# Altium schematic sheet FT4232.schdoc
size 274 x 231 mm; SheetNumber: 1; SheetTotal: 1
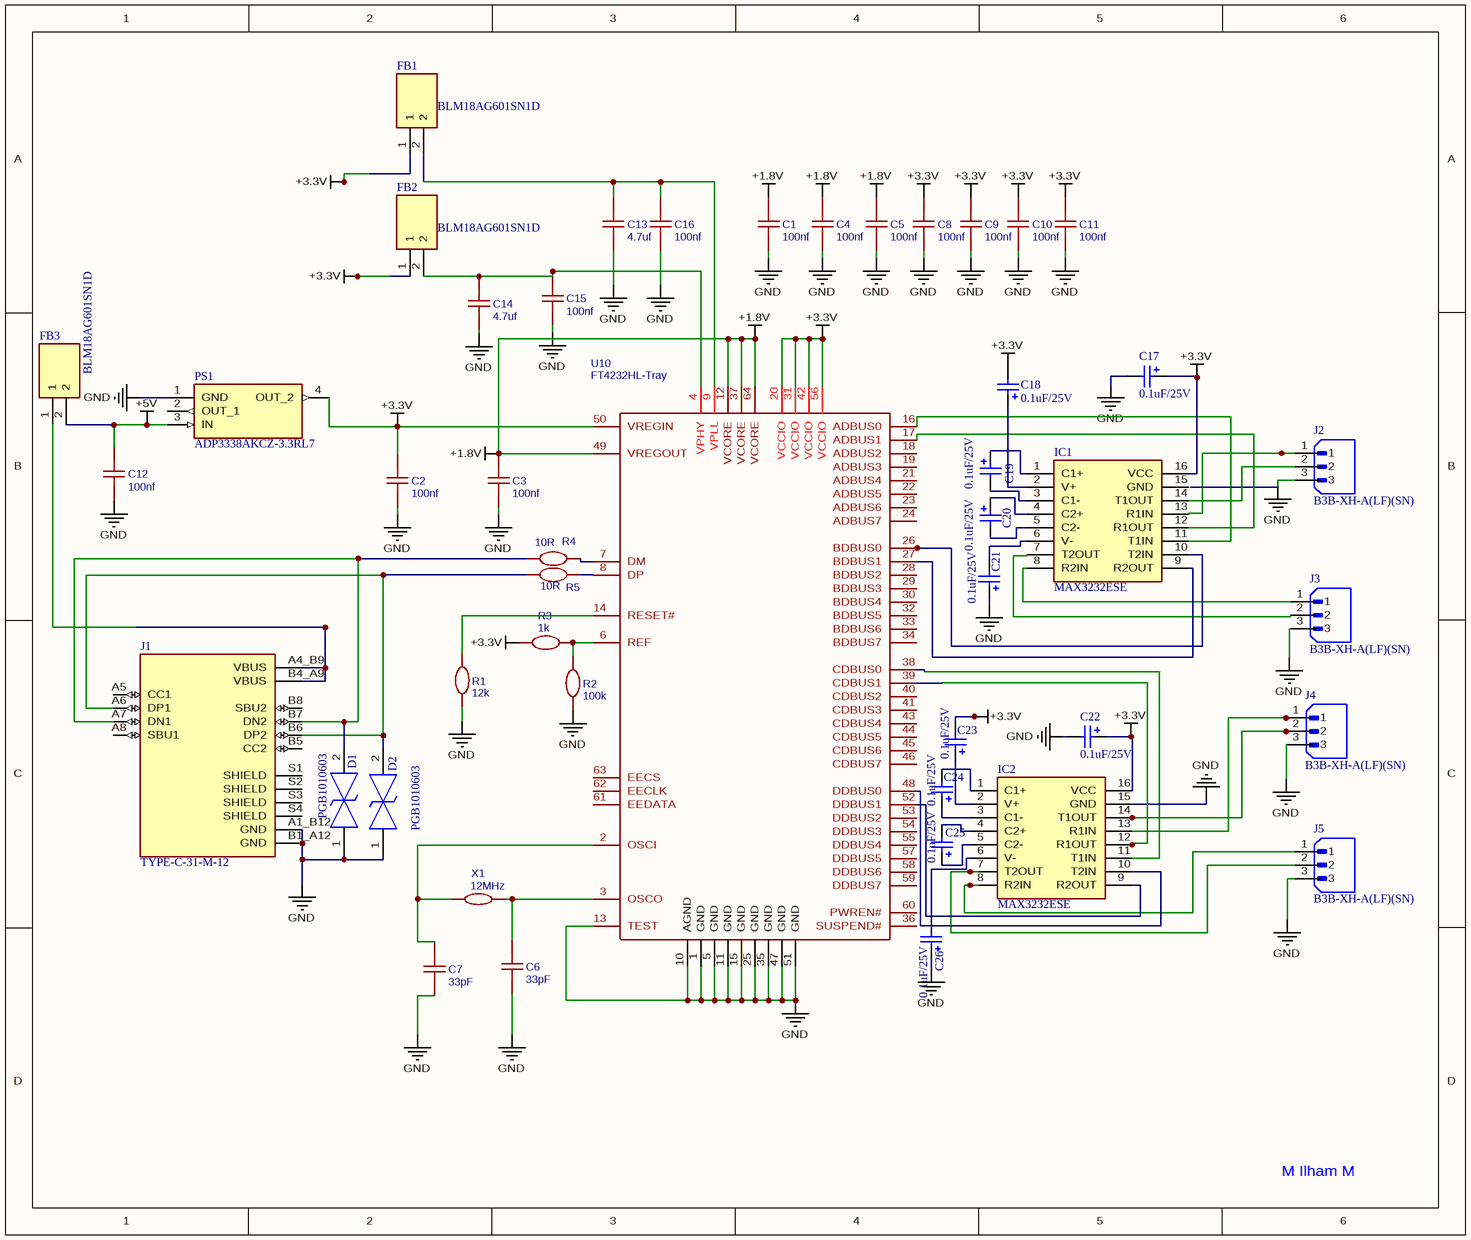
[diagram p0: FT4232.schdoc]

## Parts
C1  100nf  [1608_[0603] Capacitor]
C2  100nf  [1608_[0603] Capacitor]
C3  100nf  [1608_[0603] Capacitor]
C4  100nf  [1608_[0603] Capacitor]
C5  100nf  [1608_[0603] Capacitor]
C6  33pF  [1608_[0603] Capacitor]
C7  33pF  [1608_[0603] Capacitor]
C8  100nf  [1608_[0603] Capacitor]
C9  100nf  [1608_[0603] Capacitor]
C10  100nf  [1608_[0603] Capacitor]
C11  100nf  [1608_[0603] Capacitor]
C12  100nf  [1608_[0603] Capacitor]
C13  4.7uf  [1608_[0603] Capacitor]
C14  4.7uf  [1608_[0603] Capacitor]
C15  100nf  [1608_[0603] Capacitor]
C16  100nf  [1608_[0603] Capacitor]
C17  0.1uF/25V  [1608_[0603] Capacitor]
C18  0.1uF/25V  [1608_[0603] Capacitor]
C19  0.1uF/25V  [1608_[0603] Capacitor]
C20  0.1uF/25V  [1608_[0603] Capacitor]
C21  0.1uF/25V  [1608_[0603] Capacitor]
C22  0.1uF/25V  [1608_[0603] Capacitor]
C23  0.1uF/25V  [1608_[0603] Capacitor]
C24  0.1uF/25V  [1608_[0603] Capacitor]
C25  0.1uF/25V  [1608_[0603] Capacitor]
C26  0.1uF/25V  [1608_[0603] Capacitor]
D1  PGB1010603  [PGB1010603NRHF]
D2  PGB1010603  [PGB1010603NRHF]
FB1  BLM18AG601SN1D  [BLM18SP221SN1B]
FB2  BLM18AG601SN1D  [BLM18SP221SN1B]
FB3  BLM18AG601SN1D  [BLM18SP221SN1B]
IC1  MAX3232ESE  [SOIC127P600X175-16N]
IC2  MAX3232ESE  [SOIC127P600X175-16N]
J1  TYPE-C-31-M-12  [HRO_TYPE-C-31-M-12]
J2  B3B-XH-A(LF)(SN)  [JST_B3B-XH-A(LF)(SN)]
J3  B3B-XH-A(LF)(SN)  [JST_B3B-XH-A(LF)(SN)]
J4  B3B-XH-A(LF)(SN)  [JST_B3B-XH-A(LF)(SN)]
J5  B3B-XH-A(LF)(SN)  [JST_B3B-XH-A(LF)(SN)]
PS1  ADP3338AKCZ-3.3RL7  [SOT230P700X180-4N]
R1  12k  [1608_[0603] Resistor]
R2  100k  [1608_[0603] Resistor]
R3  1k  [1608_[0603] Resistor]
R4  10R  [1608_[0603] Resistor]
R5  10R  [1608_[0603] Resistor]
U10  FT4232HL-Tray  [QFP50P1200X1200X160-64N]
X1  12MHz  [X TAL]

## Nets
+1.8V: C1.1 C3.1 C4.1 C5.1 U10.12(VCORE) U10.37(VCORE) U10.49(VREGOUT) U10.64(VCORE)
+3.3V: C2.1 C8.1 C9.1 C10.1 C11.1 C17.1 C18.2 C22.1 C23.2 FB1.1 FB2.1 IC1.16(VCC) IC2.16(VCC) PS1.4(OUT_2) R3.1 U10.20(VCCIO) U10.31(VCCIO) U10.42(VCCIO) U10.50(VREGIN) U10.56(VCCIO)
+5V: C12.1 FB3.2 PS1.3(IN)
GND: C1.2 C2.2 C3.2 C4.2 C5.2 C6.2 C7.2 C8.2 C9.2 C10.2 C11.2 C12.2 C13.2 C14.2 C15.2 C16.2 C17.2 C21.1 C22.2 C26.1 D1.1 D2.1 IC2.15(GND) J1.A1_B12(GND) J1.B1_A12(GND) J2.3 J3.3 J4.3 J5.3 PS1.1(GND) R1.2 R2.2 U10.1(GND) U10.5(GND) U10.10(AGND) U10.11(GND) U10.13(TEST) U10.15(GND) U10.25(GND) U10.35(GND) U10.47(GND) U10.51(GND)
NetC6_1: C6.1 U10.3(OSCO) X1.2
NetC7_1: C7.1 U10.2(OSCI) X1.1
NetC13_1: C13.1 C16.1 FB1.2 U10.9(VPLL)
NetC14_1: C14.1 C15.1 FB2.2 U10.4(VPHY)
NetC18_1: C18.1 IC1.2(V+)
NetC19_1: C19.1 IC1.1(C1+)
NetC19_2: C19.2 IC1.3(C1-)
NetC20_1: C20.1 IC1.4(C2+)
NetC20_2: C20.2 IC1.5(C2-)
NetC21_2: C21.2 IC1.6(V-)
NetC23_1: C23.1 IC2.2(V+)
NetC24_1: C24.1 IC2.3(C1-)
NetC24_2: C24.2 IC2.1(C1+)
NetC25_1: C25.1 IC2.5(C2-)
NetC25_2: C25.2 IC2.4(C2+)
NetC26_2: C26.2 IC2.6(V-)
NetD1_2: D1.2 J1.A7(DN1) J1.B7(DN2) R4.1
NetD2_2: D2.2 J1.A6(DP1) J1.B6(DP2) R5.1
NetFB3_1: FB3.1 J1.A4_B9(VBUS) J1.B4_A9(VBUS)
NetIC1_7: IC1.7(T2OUT) J3.2
NetIC1_8: IC1.8(R2IN) J3.1
NetIC1_9: IC1.9(R2OUT) U10.27(BDBUS1)
NetIC1_10: IC1.10(T2IN) U10.26(BDBUS0)
NetIC1_11: IC1.11(T1IN) U10.16(ADBUS0)
NetIC1_12: IC1.12(R1OUT) U10.17(ADBUS1)
NetIC1_13: IC1.13(R1IN) J2.1
NetIC1_14: IC1.14(T1OUT) J2.2
NetIC2_7: IC2.7(T2OUT) J5.2
NetIC2_8: IC2.8(R2IN) J5.1
NetIC2_9: IC2.9(R2OUT) U10.52(DDBUS1)
NetIC2_10: IC2.10(T2IN) U10.48(DDBUS0)
NetIC2_11: IC2.11(T1IN) U10.38(CDBUS0)
NetIC2_12: IC2.12(R1OUT) U10.39(CDBUS1)
NetIC2_13: IC2.13(R1IN) J4.1
NetIC2_14: IC2.14(T1OUT) J4.2
NetR1_1: R1.1 U10.14(RESET#)
NetR2_1: R2.1 R3.2 U10.6(REF)
NetR4_2: R4.2 U10.7(DM)
NetR5_2: R5.2 U10.8(DP)

Not connected (* = marked no-connect by the designer): IC1 15(GND); J1 A5(CC1) A8(SBU1) B5(CC2) B8(SBU2) S1(SHIELD) S2(SHIELD) S3(SHIELD) S4(SHIELD); PS1 2(OUT_1); U10 18(ADBUS2) 19(ADBUS3) 21(ADBUS4) 22(ADBUS5) 23(ADBUS6) 24(ADBUS7) 28(BDBUS2) 29(BDBUS3) 30(BDBUS4) 32(BDBUS5) 33(BDBUS6) 34(BDBUS7) 36(SUSPEND#) 40(CDBUS2) 41(CDBUS3) 43(CDBUS4) 44(CDBUS5) 45(CDBUS6) 46(CDBUS7) 53(DDBUS2) 54(DDBUS3) 55(DDBUS4) 57(DDBUS5) 58(DDBUS6) 59(DDBUS7) 60(PWREN#) 61(EEDATA) 62(EECLK) 63(EECS)

## Notes on the sheet
- M Ilham M

## Library data of the parts
C1-C12 C15 C16 = 100nf: nameAlias: Value(F); Contributor: LCEDA_Lib; spicePre: C; spiceSymbolName: C_0603_US
C13 C14 = 4.7uf: nameAlias: Value(F); Contributor: LCEDA_Lib; spicePre: C; spiceSymbolName: C_0603_US
C17-C26 = Cap_1uF_POL_10%_TANA: 0603 SMD Tantalum Capacitor; PN: F981E105MMA; Revision: July-2002: Re-released for DXP Platform.
D1 D2 = PGB1010603: TVS Diode (Bi-directional); Manufacturer_Name: LITTELFUSE; Datasheet Link: https://www.littelfuse.com/data/en/data_sheets/littelfuse_pulseguard-esd_pgb1.pdf; Height: 0.36mm; Manufacturer_Part_Number: PGB1010603; Mouser Part Number: N/A; Mouser Price/Stock: https://www.mouser.co.uk/ProductDetail/Littelfuse/PGB1010603?qs=gybxhQrZOyG2aLlFMGOYoA%3D%3D
FB1-FB3 = BLM18AG601SN1D: Ferrite Bead; Manufacturer_Name: Murata Electronics; Datasheet Link: http://www.murata.com/~/media/webrenewal/support/library/catalog/products/emc/emifil/c31e.ashx?la=en-gb; Height: 0.95mm; Manufacturer_Part_Number: BLM18AG601SN1D; Mouser Part Number: 81-BLM11A601S; Mouser Price/Stock: https://www.mouser.co.uk/ProductDetail/Murata-Electronics/BLM18AG601SN1D?qs=eh6oC%2F9l24oGGaJFkAJJAA%3D%3D; Arrow Part Number: BLM18AG601SN1D; Arrow Price/Stock: https://www.arrow.com/en/products/blm18ag601sn1d/murata-manufacturing?utm_currency=USD&region=europe
IC1 IC2 = MAX232EESE+T: Integrated Circuit; Manufacturer_Name: Analog Devices; Datasheet Link: https://www.analog.com/MAX232E/datasheet; Height: 1.75mm; Manufacturer_Part_Number: MAX232EESE+T; Mouser Part Number: 700-MAX232EESET; Mouser Price/Stock: https://www.mouser.co.uk/ProductDetail/Analog-Devices-Maxim-Integrated/MAX232EESE%2bT?qs=CDqwynd4ZNo03Ae2N7OgQA%3D%3D; Arrow Part Number: MAX232EESE+T; Arrow Price/Stock: https://www.arrow.com/en/products/max232eeset/analog-devices?region=nac
J1 = TYPE-C-31-M-12: USB Connectors 24 Receptacle 1 8.94*7.3mm RoHS; MF: HRO Electronics Co., Ltd.; SnapEDA_Link: https://www.snapeda.com/parts/TYPE-C-31-M-12/HRO+Electronics+Co.%252C+Ltd./view-part/?ref=snap; Package: Package; Value: *; MP: TYPE-C-31-M-12; Check_prices: https://www.snapeda.com/parts/TYPE-C-31-M-12/HRO+Electronics+Co.%252C+Ltd./view-part/?ref=eda
J2-J5 = B3B-XH-A(LF)(SN): Connector Header Through Hole 3 position 0.098 (2.50mm); MF: JST Sales; SnapEDA_Link: https://www.snapeda.com/parts/B3B-XH-A(LF)(SN)/JST/view-part/?ref=snap; Package: None; Value: *; MP: B3B-XH-A(LF)(SN); Check_prices: https://www.snapeda.com/parts/B3B-XH-A(LF)(SN)/JST/view-part/?ref=eda
PS1 = ADP3338AKCZ-3.3RL7: Power Supply; Manufacturer_Name: Analog Devices; Datasheet Link: https://ms.componentsearchengine.com/Datasheets/2/ADP3338AKCZ-3.3RL7.pdf; Height: 1.8mm; Manufacturer_Part_Number: ADP3338AKCZ-3.3RL7; Mouser Part Number: 584-ADP3338AKCZ3.3R7; Mouser Price/Stock: https://www.mouser.co.uk/ProductDetail/Analog-Devices/ADP3338AKCZ-3.3RL7?qs=WIvQP4zGanhWiNZFvSpqBQ%3D%3D; Arrow Part Number: ADP3338AKCZ-3.3RL7; Arrow Price/Stock: https://www.arrow.com/en/products/adp3338akcz-3.3rl7/analog-devices?region=nac
R1 = 12k: nameAlias: Value(Ω); Contributor: LCEDA_Lib; spicePre: R; spiceSymbolName: R_0603_EU
R2 R4 R5 = 100k: nameAlias: Value(Ω); Contributor: LCEDA_Lib; spicePre: R; spiceSymbolName: R_0603_EU
R3 = 1k: nameAlias: Value(Ω); Contributor: LCEDA_Lib; spicePre: R; spiceSymbolName: R_0603_EU
X1 = 12MHz: Manufacturer: CTS(西迪斯); Manufacturer Part: ATS240CSM-1E; Contributor: LCSC; nameAlias: Value; Supplier: LCSC; Supplier Part: C1985692; JLCPCB Part Class: Extended Part; spicePre: X; spiceSymbolName: ATS240CSM-1E
U10 = FT4232HL-Tray: spicePre: U; spiceSymbolName: FT4232HL-Tray